# Altium schematic sheet PIC18F57Q84_Curiosity_Nano_Revision_History.SchDoc
size A3; SheetTitle: Revision History; CompanyName: Microchip Technology Inc.; Organization: Microchip Technology; Address1: 2355 West Chandler Blvd.; Address2: Chandler, AZ  85224; Address4: USA; SheetNumber: 4; SheetTotal: 4; Time: Time
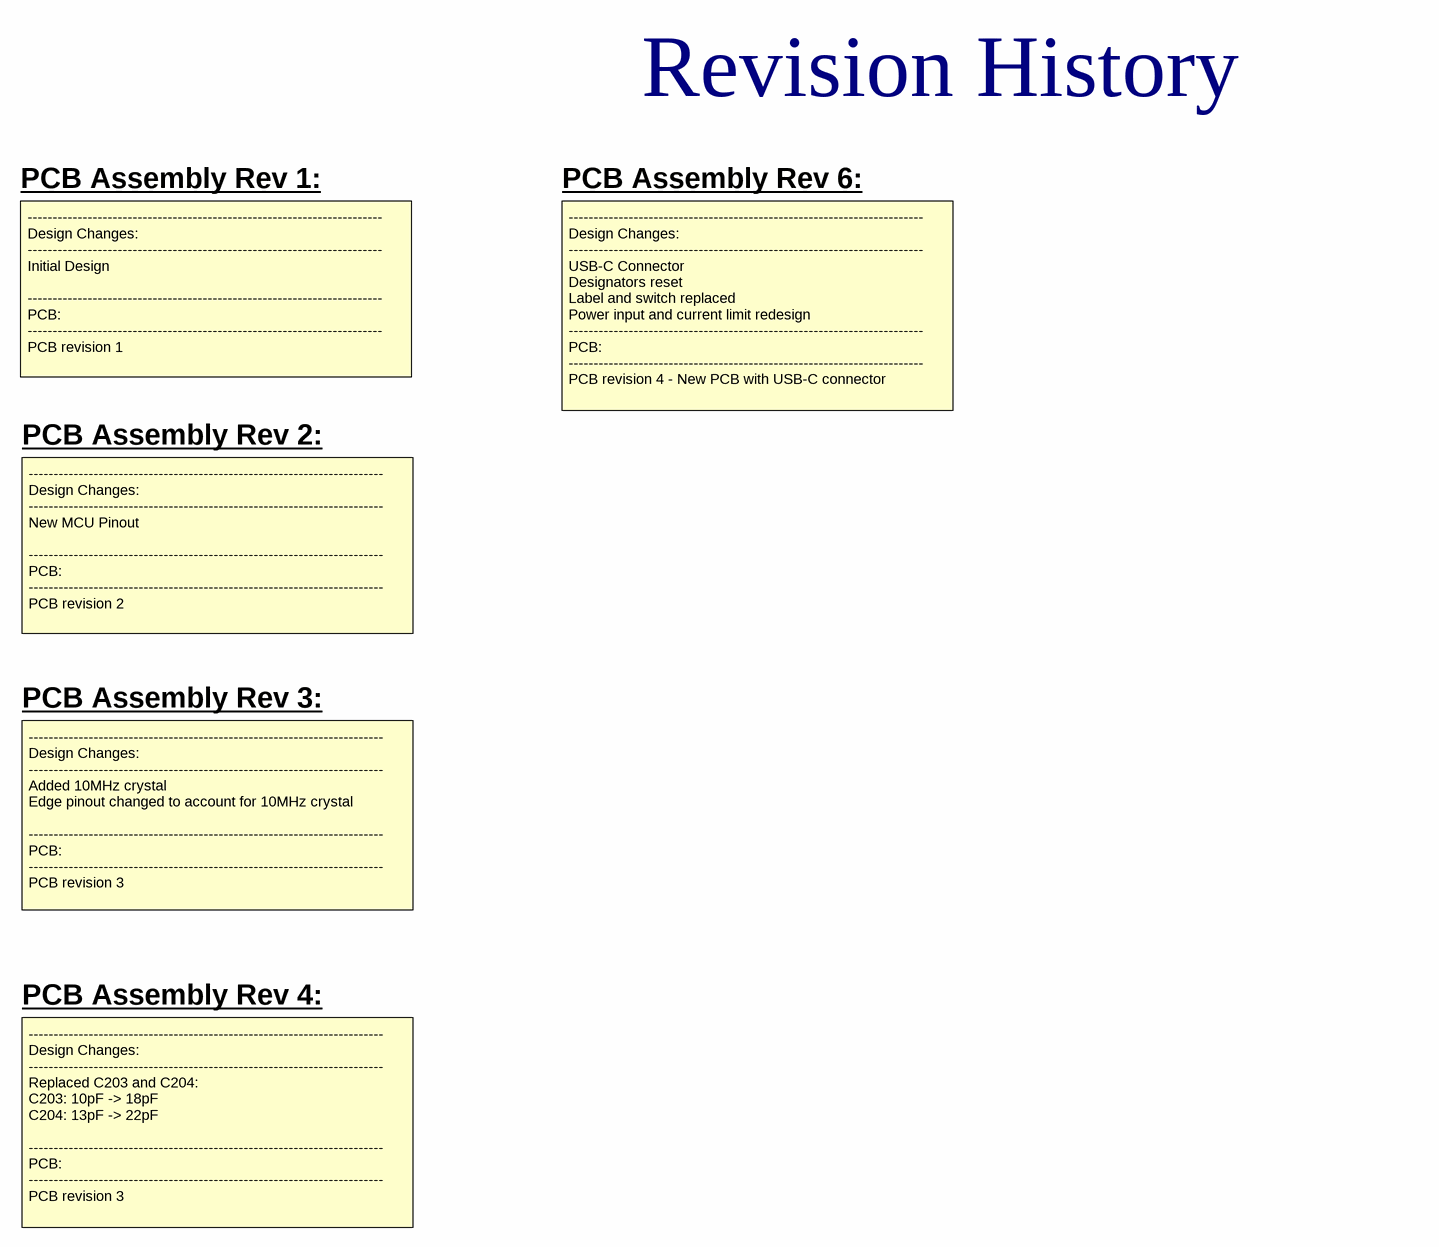
[diagram p0: PIC18F57Q84_Curiosity_Nano_Revision_History.SchDoc]

## Notes on the sheet
- Revision History
- PCB Assembly Rev 1:
- PCB Assembly Rev 6:
- -----------------------------------------------------------------------
  Design Changes:
  -----------------------------------------------------------------------
  Initial Design
  -----------------------------------------------------------------------
  PCB:
  -----------------------------------------------------------------------
  PCB revision 1
- PCB Assembly Rev 2:
- -----------------------------------------------------------------------
  Design Changes:
  -----------------------------------------------------------------------
  USB-C Connector
  Designators reset
  Label and switch replaced
  Power input and current limit redesign
  -----------------------------------------------------------------------
  PCB:
  -----------------------------------------------------------------------
  PCB revision 4 - New PCB with USB-C connector
- -----------------------------------------------------------------------
  Design Changes:
  -----------------------------------------------------------------------
  New MCU Pinout
  -----------------------------------------------------------------------
  PCB:
  -----------------------------------------------------------------------
  PCB revision 2
- PCB Assembly Rev 3:
- -----------------------------------------------------------------------
  Design Changes:
  -----------------------------------------------------------------------
  Added 10MHz crystal
  Edge pinout changed to account for 10MHz crystal
  -----------------------------------------------------------------------
  PCB:
  -----------------------------------------------------------------------
  PCB revision 3
- PCB Assembly Rev 4:
- -----------------------------------------------------------------------
  Design Changes:
  -----------------------------------------------------------------------
  Replaced C203 and C204:
  C203: 10pF -> 18pF
  C204: 13pF -> 22pF
  -----------------------------------------------------------------------
  PCB:
  -----------------------------------------------------------------------
  PCB revision 3
- Project Owner:
- PCB Layout Contact:
- PartNumber:
- Project Title
- Variant:
- Sheet Title
- Size
- A3
- SCH #:
- PCB #:
- Rev:
- Date:
- Sheet
- Designed with
- Altium.com <http://go.altium.com/MicrochipLandingPage_Evaluation.html>
- File: